# Altium schematic sheet power.SchDoc
size A4; PageSetup: Record=PageOptions|CenterHorizontal=True|CenterVertical=True|PrintScale=1.00|XCorrection=1.00|YCorrection=1.00|PrintKind=1|BorderSize=5000000|LeftOffset=0|BottomOffset=0|Orientation=2|PaperLength=1000|PaperWidth=1000|Scale=100|PaperSource=7|PrintQuality=-4|MediaType=1|DitherType=10|PaperKind=A4|PrintScaleMode=1
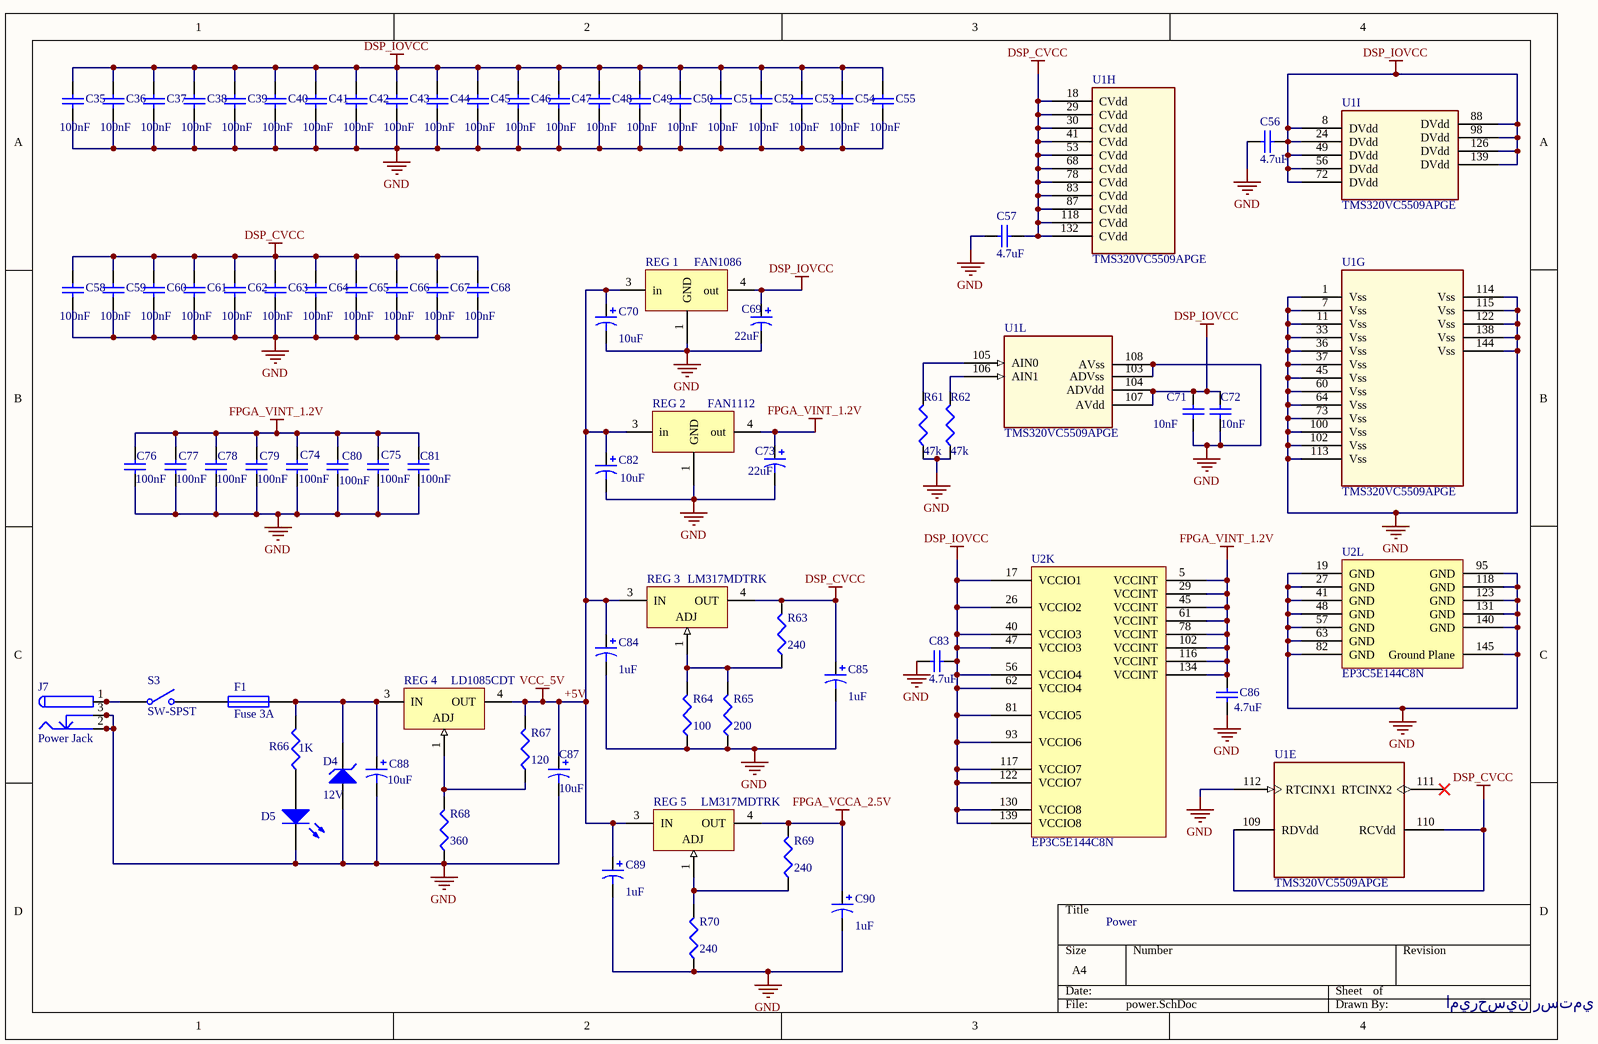
[diagram p0: power.SchDoc]

## Parts
C35  100nF  [1608[0603]]
C36  100nF  [1608[0603]]
C37  100nF  [1608[0603]]
C38  100nF  [1608[0603]]
C39  100nF  [1608[0603]]
C40  100nF  [1608[0603]]
C41  100nF  [1608[0603]]
C42  100nF  [1608[0603]]
C43  100nF  [1608[0603]]
C44  100nF  [1608[0603]]
C45  100nF  [1608[0603]]
C46  100nF  [1608[0603]]
C47  100nF  [1608[0603]]
C48  100nF  [1608[0603]]
C49  100nF  [1608[0603]]
C50  100nF  [1608[0603]]
C51  100nF  [1608[0603]]
C52  100nF  [1608[0603]]
C53  100nF  [1608[0603]]
C54  100nF  [1608[0603]]
C55  100nF  [1608[0603]]
C56  4.7uF  [1608[0603]]
C57  4.7uF  [1608[0603]]
C58  100nF  [1608[0603]]
C59  100nF  [1608[0603]]
C60  100nF  [1608[0603]]
C61  100nF  [1608[0603]]
C62  100nF  [1608[0603]]
C63  100nF  [1608[0603]]
C64  100nF  [1608[0603]]
C65  100nF  [1608[0603]]
C66  100nF  [1608[0603]]
C67  100nF  [1608[0603]]
C68  100nF  [1608[0603]]
C69  22uF  [C1206]
C70  10uF  [C1206]
C71  value 10nF  [1608[0603]]  (hidden comment: 1onF)
C72  10nF  [1608[0603]]
C73  22uF  [C1206]
C74  100nF  [1608[0603]]
C75  100nF  [1608[0603]]
C76  100nF  [1608[0603]]
C77  100nF  [1608[0603]]
C78  100nF  [1608[0603]]
C79  100nF  [1608[0603]]
C80  100nF  [1608[0603]]
C81  100nF  [1608[0603]]
C82  10uF  [C1206]
C83  4.7uF  [1608[0603]]
C84  1uF  [C1206]
C85  1uF  [C1206]
C86  4.7uF  [1608[0603]]
C87  value 10uF  [C1206]  (hidden comment: 22uF)
C88  10uF  [C1206]
C89  1uF  [C1206]
C90  1uF  [C1206]
D4  12V  [MELF-D3512-1405]
D5  LED green  [1.6X0.8X0.4]  (value not drawn)
F1  Fuse 3A  [2012[0805]]
J7  Power Jack  [KLD-0202]
R61  47K  [J1-0603]
R62  47k  [J1-0603]
R63  240  [J1-0603]
R64  100  [J1-0603]
R65  200  [J1-0603]
R66  1K  [J1-0603]
R67  120  [J1-0603]
R68  360  [J1-0603]
R69  240  [J1-0603]
R70  240  [J1-0603]
REG_1  FAN1086  [369A-13]
REG_2  FAN1112  [369A-13]
REG_3  LM317MDTRK  [369A-13]
REG_4  LD1085CDT  [369A-13]
REG_5  LM317MDTRK  [369A-13]
S3  SW-SPST  [DIP_SW_1]
U1  TMS320VC5509APGE  [TMSVC5509APGA]  (parts E,G,H,I,L of 16)
U2  EP3C5E144C8N  [EQFP144_N]  (parts K,L of 13)

## Nets
+5V: C70.1 C82.1 C84.1 C87.1 C89.1 R67.2 REG_1.3(in) REG_2.3(in) REG_3.3(IN) REG_4.4(OUT) REG_5.3(IN)  [also labelled VCC_5V]
DSP_CVCC: C57.2 C58.1 C59.1 C60.1 C61.1 C62.1 C63.1 C64.1 C65.1 C66.1 C67.1 C68.1 C85.1 R63.2 REG_3.4(OUT) U1.18(CVdd) U1.29(CVdd) U1.30(CVdd) U1.41(CVdd) U1.53(CVdd) U1.68(CVdd) U1.78(CVdd) U1.83(CVdd) U1.87(CVdd) U1.109(RDVdd) U1.110(RCVdd) U1.118(CVdd) U1.132(CVdd)
DSP_IOVCC: C35.1 C36.1 C37.1 C38.1 C39.1 C40.1 C41.1 C42.1 C43.1 C44.1 C45.1 C46.1 C47.1 C48.1 C49.1 C50.1 C51.1 C52.1 C53.1 C54.1 C55.1 C56.2 C69.1 C71.1 C72.1 C83.1 REG_1.4(out) U1.8(DVdd) U1.24(DVdd) U1.49(DVdd) U1.56(DVdd) U1.72(DVdd) U1.88(DVdd) U1.98(DVdd) U1.104(ADVdd) U1.107(AVdd) U1.126(DVdd) U1.139(DVdd) U2.17(VCCIO1) U2.26(VCCIO2) U2.40(VCCIO3) U2.47(VCCIO3) U2.56(VCCIO4) U2.62(VCCIO4) U2.81(VCCIO5) U2.93(VCCIO6) U2.117(VCCIO7) U2.122(VCCIO7) U2.130(VCCIO8) U2.139(VCCIO8)
FPGA_VCCA_2.5V: C90.1 R69.2 REG_5.4(OUT)
FPGA_VINT_1.2V: C73.1 C74.1 C75.1 C76.1 C77.1 C78.1 C79.1 C80.1 C81.1 C86.2 REG_2.4(out) U2.5(VCCINT) U2.29(VCCINT) U2.45(VCCINT) U2.61(VCCINT) U2.78(VCCINT) U2.102(VCCINT) U2.116(VCCINT) U2.134(VCCINT)
GND: C35.2 C36.2 C37.2 C38.2 C39.2 C40.2 C41.2 C42.2 C43.2 C44.2 C45.2 C46.2 C47.2 C48.2 C49.2 C50.2 C51.2 C52.2 C53.2 C54.2 C55.2 C56.1 C57.1 C58.2 C59.2 C60.2 C61.2 C62.2 C63.2 C64.2 C65.2 C66.2 C67.2 C68.2 C69.2 C70.2 C71.2 C72.2 C73.2 C74.2 C75.2 C76.2 C77.2 C78.2 C79.2 C80.2 C81.2 C82.2 C83.2 C84.2 C85.2 C86.1 C87.2 C88.2 C89.2 C90.2 D4.1(A) D5.2(K) J7.2 J7.2A J7.2B J7.3 J7.3A J7.3B R61.1 R62.1 R64.1 R65.1 R68.1 R70.1 REG_1.1(GND) REG_2.1(GND) U1.1(Vss) U1.7(Vss) U1.11(Vss) U1.33(Vss) U1.36(Vss) U1.37(Vss) U1.45(Vss) U1.60(Vss) U1.64(Vss) U1.73(Vss) U1.100(Vss) U1.102(Vss) U1.103(ADVss) U1.108(AVss) U1.112(RTCINX1) U1.113(Vss) U1.114(Vss) U1.115(Vss) U1.122(Vss) U1.138(Vss) U1.144(Vss) U2.19(GND) U2.27(GND) U2.41(GND) U2.48(GND) U2.57(GND) U2.63(GND) U2.82(GND) U2.95(GND) U2.118(GND) U2.123(GND) U2.131(GND) U2.140(GND) U2.145(Ground_Plane)
NetC88_1: C88.1 D4.2(K) F1.2 R66.2 REG_4.3(IN)
NetD5_1: D5.1(A) R66.1
NetF1_1: F1.1 S3.2(NO)
NetJ7_1: J7.1 J7.1A J7.1B S3.1(COMMON)
NetR61_2: R61.2 U1.105(AIN0)
NetR62_2: R62.2 U1.106(AIN1)
NetR63_1: R63.1 R64.2 R65.2 REG_3.1(ADJ)
NetR67_1: R67.1 R68.2 REG_4.1(ADJ)
NetR69_1: R69.1 R70.2 REG_5.1(ADJ)

Not connected (* = marked no-connect by the designer): U1 111(RTCINX2)*

## Notes on the sheet
- Power
- اميرحسين رستمي

## Library data of the parts
C35-C68 C71 C72 C74-C81 C83 C86 = Cap Semi: Capacitor; Published: 8-Jun-2000; LatestRevisionDate: 17-Jul-2002; LatestRevisionNote: Re-released for DXP Platform.; PackageReference: C1206; Publisher: Altium Limited
  C35-C55 C58-C68 C74-C81: Value: 100nF
  C56 C57 C83 C86: Value: 4.7uF
  C72: Value: 10nF
C69 C70 C73 C82 C84 C85 C87-C90 = Cap Pol3: Polarized Capacitor (Tantalium); Published: 8-Jun-2000; LatestRevisionDate: 17-Jul-2002; LatestRevisionNote: Re-released for DXP Platform.; PackageReference: C0805; Publisher: Altium Limited
  C69 C73: Value: 22uF
  C70 C82 C88: Value: 10uF
  C84 C85 C89 C90: Value: 1uF
D4 = DL4742A: Silicon Zener Diode; Published: 8-Jun-2000; LatestRevisionDate: 19-Mar-2004; LatestRevisionNote: Silkscreen size reduced.; PackageReference: DL-41; Publisher: Altium Limited; Code_IPC: SOD-87/MLL41; ComponentLink1Description: Manufacturer Link; ComponentLink1URL: http://www.vishay.com/
D5 = LED3: Typical BLUE SiC LED; Published: 8-Jun-2000; LatestRevisionDate: 17-Dec-2003; LatestRevisionNote: PCB Footprint replaced.; DatasheetDocument: 16-Apr-2002; PackageDocument: 16-Apr-2002; PackageReference: 3.5X2.8X1.9; Publisher: Altium Limited
F1 = Fuse 1: Fuse; Published: 8-Jun-2000; LatestRevisionDate: 17-Jul-2002; LatestRevisionNote: Re-released for DXP Platform.; PackageReference: PIN-W2/E2.8; Publisher: Altium Limited
J7 = PWR2.5: Low Voltage Power Supply Connector; Published: 17-Dec-2003; DatasheetDocument: 09-May-2002; Publisher: Altium Limited; ComponentLink1Description: Manufacturer Link; ComponentLink1URL: http://domino.kycon.com/internet/Products.html
R61-R70 = Res3: Resistor; Published: 8-Jun-2000; LatestRevisionDate: 04-Mar-2005; LatestRevisionNote: PCB Footprint replaced.; PackageReference: J1-0603; Publisher: Altium Limited
  R61 R62: Value: 47k
  R63 R69 R70: Value: 240
  R64: Value: 100
  R65: Value: 200
  R66: Value: 1K
  R67: Value: 120
  R68: Value: 360
REG_1 = FAN1086: 1.5A, 3.3V Fixed Low Dropout Linear Regulator
REG_2 = FAN1112: 1A 1.2V Low Dropout Linear Regulator
REG_3 REG_5 = LM317MDTRK: Three-Terminal Adjustable Output Positive Voltage Regulator; Note: Pin 2 is electrically connected to Pin 4 (TAB); Pin 2 is trimmed and not drawn; Published: 15-Apr-2002; DatasheetVersion: Nov-1999; PackageVersion: 1997; PackageReference: 369A-13; Publisher: Altium Limited; PackageDescription: D-PAK/TO-252-AA; 3 Leads (1 Cropped); Body 10.3 (inc. leads) x 6.7 mm (LxW max); ComponentLink1Description: Manufacturer Link; ComponentLink1URL: http://www.onsemi.com/site/products/taxonomy/0,4438,503,00.html; ComponentLink2Description: Datasheet; ComponentLink2URL: http://www.onsemi.com/pub/Collateral/LM317M-D.PDF
REG_4 = LM317MDT: Three-Terminal Adjustable Output Positive Voltage Regulator; Note: Pin 2 is electrically connected to Pin 4 (TAB); Pin 2 is trimmed and not drawn; Published: 15-Apr-2002; DatasheetVersion: Nov-1999; PackageVersion: 1997; PackageReference: 369A-13; Publisher: Altium Limited; PackageDescription: D-PAK/TO-252-AA; 3 Leads (1 Cropped); Body 10.3 (inc. leads) x 6.7 mm (LxW max); ComponentLink1Description: Manufacturer Link; ComponentLink1URL: http://www.onsemi.com/site/products/taxonomy/0,4438,503,00.html; ComponentLink2Description: Datasheet; ComponentLink2URL: http://www.onsemi.com/pub/Collateral/LM317M-D.PDF
S3 = SW-SPST: Single-Pole, Single-Throw Switch; Published: 24-Mar-1999; LatestRevisionDate: 17-Jul-2002; LatestRevisionNote: Re-released for DXP Platform.; PackageReference: SPST-2; Publisher: Altium Limited
U2 = EP3C5E144C8N: Cyclone III Family FPGA, 94 I/O Pins, 4 PLLs, 144-Pin EQFP, Speed Grade 8, Commercial Grade, Pb-Free; Note: Exposed pad at the bottom of this package must be connected to PCB GND.; Published: 14-Mar-2008; LatestRevisionDate: 27-Jun-2008; LatestRevisionNote: Sch pin for exposed pad added.; DatasheetVersion: ver2.0, May-2008; PackageVersion: ver15.1, May-2008; PackageReference: EQFP144; Publisher: Altium Limited; PackageDescription: 144-Pin Plastic Enhanced Quad Flat Pack (EQFP144) - Wire Bond; Code_JEDEC: MS-026-BFB; ComponentLink1Description: Manufacturer Link; ComponentLink1URL: http://www.altera.com/; ComponentLink2Description: Handbook (7.86MB); ComponentLink2URL: http://www.altera.com/literature/hb/cyc3/cyclone3_handbook.pdf; ComponentLink3Description: Packaging Specification; ComponentLink3URL: http://www.altera.com/literature/ds/dspkg.pdf